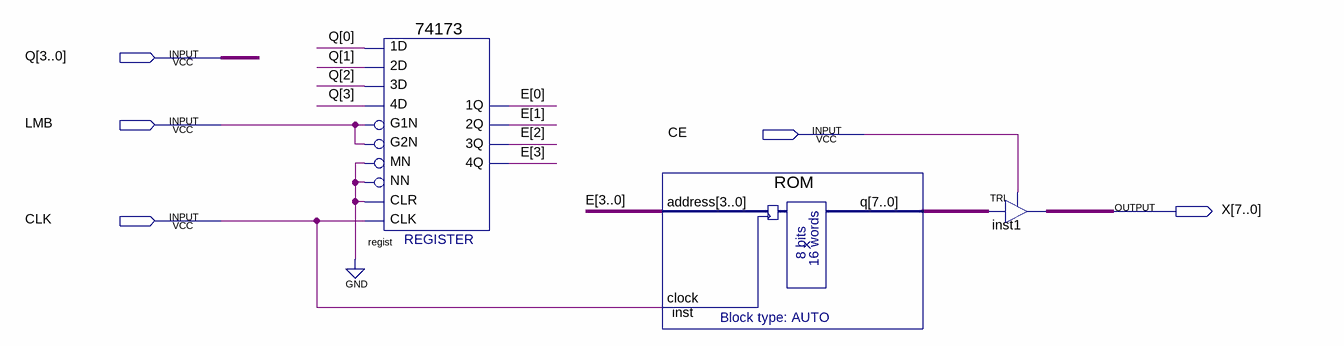
[diagram p0: schematic sheet]
// Quartus schematic Unidade_de_Memoria.bdf as structural Verilog: 3 symbols, 5 pins
module Unidade_de_Memoria (
  input  [3:0] Q,
  input  LMB,
  input  CE,
  input  CLK,
  output [7:0] X
);

  wire [3:0] E;
  wire [7:0] inst_q;

  \74173  regist (
    .\3D (Q[2]), .MN(1'b0), .\1D (Q[0]), .\2D (Q[1]), .\4D (Q[3]), .G1N(LMB), .G2N(LMB), .NN(1'b0),
    .CLR(1'b0), .CLK(CLK), .\3Q (E[2]), .\2Q (E[1]), .\1Q (E[0]), .\4Q (E[3]));
  ROM inst (.address(E), .clock(CLK), .q(inst_q));
  TRI inst1[7:0] (.IN(inst_q), .OE(CE), .OUT(X));
endmodule
